# Altium project microcp.prjpcb
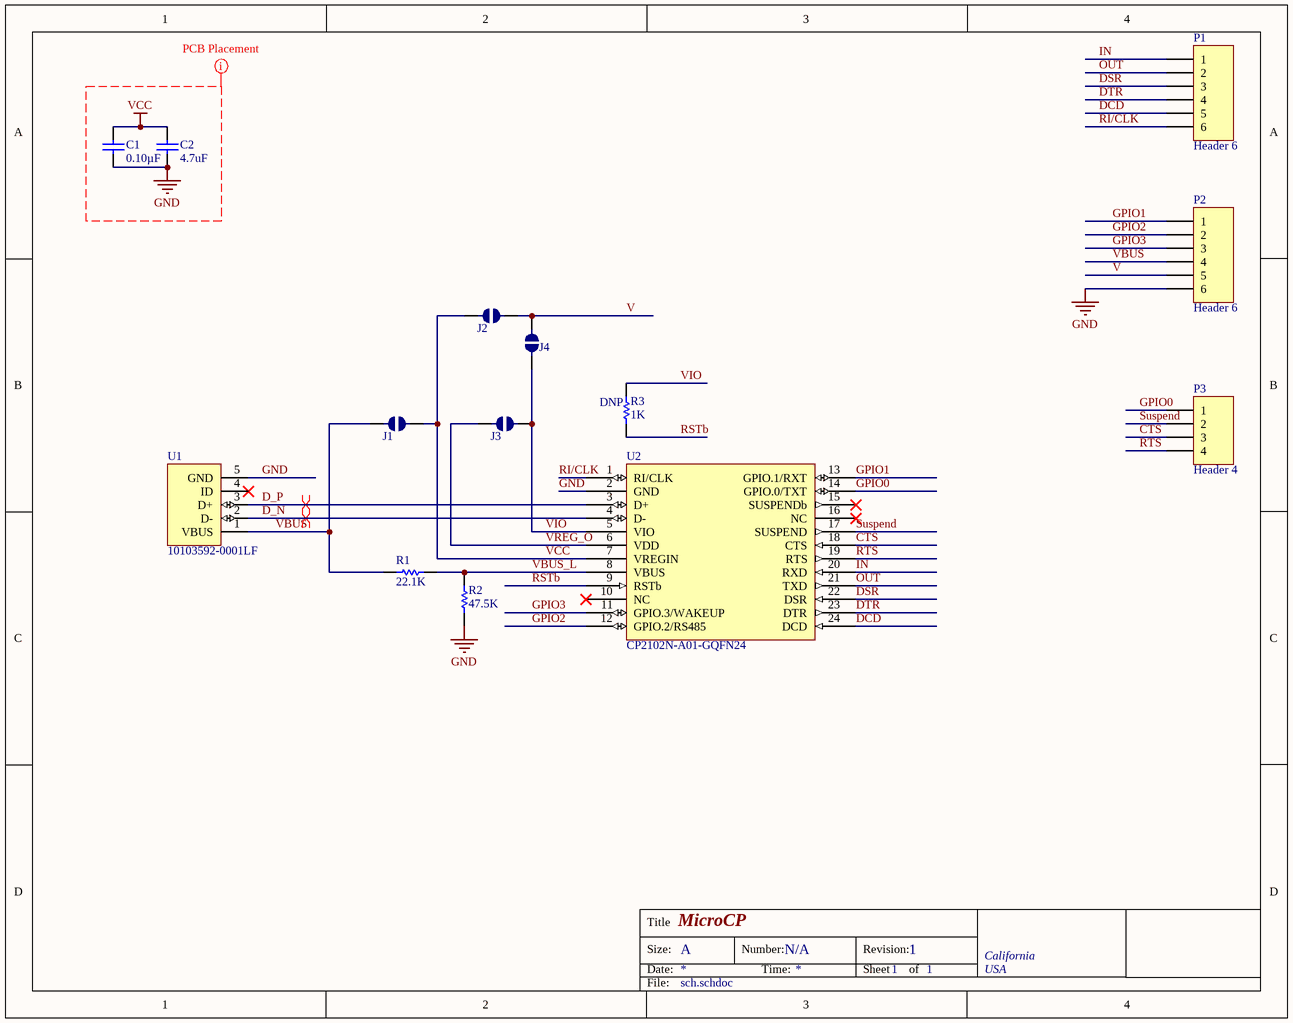
[diagram p0: sch.schdoc]
1 sheet, 14 parts. Net scope: global (net labels, ports and power ports of the same name join across sheets).
Board file: pcb.pcbdoc

## Sheet sch.schdoc: MicroCP
size A; Author: Faisal T. Abu-Nimeh; CompanyName: abunimeh; DrawnBy: Faisal Abu-Nimeh; Engineer: Faisal Abu-Nimeh; Address3: California; Address4: USA; DocumentNumber: N/A; Revision: 1; SheetNumber: 1; SheetTotal: 1; ProjectName: MicroCP

### Parts
C1  0.10µF  [0402L]
C2  4.7uF  [0402L]
J1  Jumper_Open  [JO]  (value not drawn)
J2  Jumper_Open  [JO]  (value not drawn)
J3  Jumper_Open  [JO]  (value not drawn)
J4  Jumper_Open  [JO]  (value not drawn)
P1  Header 6  [HDR1X6]
P2  Header 6  [HDR1X6]
P3  Header 4  [HDR1X4]
R1  22.1K  [0402L]
R2  47.5K  [0402L]
R3  1K  [RESC0402(1005)_L]
U1  10103592-0001LF  [10103592-0001LF_NOSLOTS]
U2  CP2102N-A01-GQFN24  [CP2102N-QFN24]

### Nets
GND: C1.1 C2.1 P2.6 R2.1 U1.0 U1.5(GND) U2.0(GND) U2.2(GND)
VCC: C1.2 C2.2 J1.2 J2.1 U2.7(VREGIN)
CTS: P3.3 U2.18(CTS)
D_N: U1.2(D-) U2.4(D-)
D_P: U1.3(D+) U2.3(D+)
DCD: P1.5 U2.24(DCD)
DSR: P1.3 U2.22(DSR)
DTR: P1.4 U2.23(DTR)
GPIO0: P3.1 U2.14(GPIO.0/TXT)
GPIO1: P2.1 U2.13(GPIO.1/RXT)
GPIO2: P2.2 U2.12(GPIO.2/RS485)
GPIO3: P2.3 U2.11(GPIO.3/WAKEUP)
IN: P1.1 U2.20(RXD)
OUT: P1.2 U2.21(TXD)
RI/CLK: P1.6 U2.1(RI/CLK)
RSTb: R3.1 U2.9(RSTb)
RTS: P3.4 U2.19(RTS)
Suspend: P3.2 U2.17(SUSPEND)
V: J2.2 J4.2 P2.5
VBUS: J1.1 P2.4 R1.2 U1.1(VBUS)
VBUS_L: R1.1 R2.2 U2.8(VBUS)
VIO: J3.2 J4.1 R3.2 U2.5(VIO)
VREG_O: J3.1 U2.6(VDD)

Not connected (* = marked no-connect by the designer): U1 4(ID)*; U2 10(NC)* 15(SUSPENDb)* 16(NC)*

### Layout directives
differential pair: D_N, D_P
mark named PCB Placement: GND, VCC

### Notes on the sheet
- Title
- Size:
- Date:
- A
- Number:
- Time:
- Revision:
- Sheet
- of
- File:

### Library data of the parts
C1 = CMP-1034-02061-1: CAP CER 0.1UF 16V X7R 0402; Manufacturer: Murata Electronics North America; Manufacturer Part Number: GRM155R71C104KA88D; Tolerance: ±10%; Supplier 1: Digi-Key; Supplier Part Number 1: 490-6328-2-ND; RoHS: RoHS Compliant; Category: Capacitors; Stock 1: 8950000; Pricing 1: 50000=0.0017, 100000=0.00138 (USD); Packaging: Tape & Reel (TR); Part Status: Active; Capacitance: 0.10µF; Voltage - Rated: 16V; Temperature Coefficient: X7R; Operating Temperature: -55°C ~ 125°C; Features: -; Ratings: -; Applications: General Purpose; Failure Rate: *; Mounting Type: Surface Mount, MLCC; Package / Case: 0402 (1005 Metric); Size / Dimension: 0.039" L x 0.020" W (1.00mm x 0.50mm); Height - Seated (Max): -; Thickness (Max): 0.022" (0.55mm); Lead Spacing: -; Lead Style: -; ComponentLink1URL: http://www.murata.com/~/media/webrenewal/support/library/catalog/products/capacitor/mlcc/c02e.pdf; ComponentLink1Description: http://www.murata.com/~/media/webrenewal/support/library/catalog/products/capacitor/mlcc/c02e.pdf; Value: 0.10µF
C2 = CMP-1034-02136-1: CAP 4.7uF 6.3V ±10% 0402 SMD; Manufacturer Part Number: GRM155R60J475ME47D; Manufacturer: Murata; Case-EIA: 0402; Tolerance: Â±10%; Case-Metric: 1005; Technology: SMT; Value: 4.7uF; Max Thickness: 0.6 mm; Rated Voltage: 6.3 V; Supplier 1: Digi-Key; Supplier Part Number 1: 490-5915-2-ND
J1-J4 = Jumper_Open: Open SMD Solder Jumper; DNP: DNP
P1 P2 = Header 6: Header, 6-Pin; LatestRevisionDate: 17-Jul-2002; LatestRevisionNote: Re-released for DXP Platform.; Publisher: Altium Limited; DNP: DNP
P3 = Header 4: Header, 4-Pin; LatestRevisionDate: 17-Jul-2002; LatestRevisionNote: Re-released for DXP Platform.; Publisher: Altium Limited; DNP: DNP
R1 = CMP-1011-00001-1: 22.1K SMD Resistor 0402; Manufacturer: Panasonic Electronic Components; Manufacturer Part Number: ERJ-2RKF2212X; Tolerance: None; Case-Metric: 1005; Case-EIA: 0402; Power (Watts): 0.1W, 1/10W; Temperature Coefficient: ±100ppm/°C; Power: None; Value: 22.1K; Technology: SMT; Supplier 1: Digi-Key; Supplier Part Number 1: P22.1KLTR-ND; RoHS: RoHS Compliant; Category: Resistors; Stock 1: 280000; Pricing 1: 10000=0.00281, 30000=0.00247, 50000=0.00226, 100000=0.00222 (USD); Packaging: Tape & Reel (TR); Part Status: Active; Resistance (Ohms): 22.1k; Composition: Thick Film; Features: Automotive AEC-Q200; Operating Temperature: -55°C ~ 155°C; Package / Case: 0402 (1005 Metric); Supplier Device Package: 0402; Size / Dimension: 0.039" L x 0.020" W (1.00mm x 0.50mm); Height: 0.016" (0.40mm); Number of Terminations: 2; Failure Rate: -; ComponentLink1URL: http://industrial.panasonic.com/www-cgi/jvcr13pz.cgi?E+PZ+3+AOA0002+ERJ2RKF2212X+7+WW; ComponentLink1Description: http://industrial.panasonic.com/www-cgi/jvcr13pz.cgi?E+PZ+3+AOA0002+ERJ2RKF2212X+7+WW
R2 = CMP-1011-00001-1: 47.5K SMD Resistor 0402; Manufacturer Part Number: ERJ-2RKF4752X; Manufacturer: Panasonic; Tolerance: None; Case-Metric: 1005; Case-EIA: 0402; Power (Watts): 0.1W, 1/10W; Temperature Coefficient: ±100ppm/°C; Power: None; Value: 47.5K; Technology: SMT; Supplier 1: Digi-Key; Supplier Part Number 1: P47.5KLTR-ND; RoHS: RoHS Compliant; Category: Resistors; Stock 1: 260000; Pricing 1: 10000=0.00281, 30000=0.00247, 50000=0.00226, 100000=0.00222 (USD); Packaging: Tape & Reel (TR); Part Status: Active; Resistance (Ohms): 47.5k; Composition: Thick Film; Features: Automotive AEC-Q200; Operating Temperature: -55°C ~ 155°C; Package / Case: 0402 (1005 Metric); Supplier Device Package: 0402; Size / Dimension: 0.039" L x 0.020" W (1.00mm x 0.50mm); Height: 0.016" (0.40mm); Number of Terminations: 2; Failure Rate: -; ComponentLink1URL: http://industrial.panasonic.com/www-cgi/jvcr13pz.cgi?E+PZ+3+AOA0002+ERJ2RKF4752X+7+WW; ComponentLink1Description: http://industrial.panasonic.com/www-cgi/jvcr13pz.cgi?E+PZ+3+AOA0002+ERJ2RKF4752X+7+WW
R3 = CMP-1011-00001-1: RES SMD 1K OHM 1% 1/10W 0402; Manufacturer: Panasonic Electronic Components; Manufacturer Part Number: ERJ-2RKF1001X; Power (Watts): 0.1W, 1/10W; Temperature Coefficient: ±100ppm/°C; DNP: DNP; Supplier 1: Digi-Key; Supplier Part Number 1: P1.00KLCT-ND; RoHS: RoHS Compliant; Category: Resistors; Stock 1: 4728383; Pricing 1: 1=0.1, 50=0.015, 100=0.011, 250=0.0084, 500=0.00674, 1000=0.00496, 5000=0.00355 (USD); Packaging: Cut Tape (CT); Part Status: Active; Resistance (Ohms): 1k; Tolerance: ±1%; Composition: Thick Film; Features: Automotive AEC-Q200; Operating Temperature: -55°C ~ 155°C; Package / Case: 0402 (1005 Metric); Supplier Device Package: 0402; Size / Dimension: 0.039" L x 0.020" W (1.00mm x 0.50mm); Height: 0.016" (0.40mm); Number of Terminations: 2; Failure Rate: -; ComponentLink1URL: http://industrial.panasonic.com/www-cgi/jvcr13pz.cgi?E+PZ+3+AOA0002+ERJ2RKF1001X+7+WW; ComponentLink1Description: http://industrial.panasonic.com/www-cgi/jvcr13pz.cgi?E+PZ+3+AOA0002+ERJ2RKF1001X+7+WW
U1 = 10103592-0001LF: CONN RCPT REV MICRO USB TYPE B; Manufacturer: Amphenol FCI; Connector Type: USB - micro B; Number of Contacts: 5; Gender: Receptacle; Specifications: USB 2.0; Supplier 1: Digi-Key; Manufacturer Part Number: 10103592-0001LF; RoHS: RoHS Compliant; Category: Connectors, Interconnects; Stock 1: 17913; Pricing 1: 1=0.76, 10=0.712, 25=0.6412, 50=0.57, 100=0.5462, 250=0.49872, 500=0.47498 (USD); Packaging: Cut Tape (CT); Part Status: Active; Mounting Type: Surface Mount, Right Angle, Horizontal; Features: Shielded, Solder Retention; Ingress Protection: -; ComponentLink1URL: http://portal.fciconnect.com/Comergent//fci/drawing/10103592.pdf; ComponentLink1Description: http://portal.fciconnect.com/Comergent//fci/drawing/10103592.pdf; Supplier Part Number 1: 609-4048-1-ND
U2 = CP2102N-QFN24: USB-UART; Manufacturer: Silicon Labs; Supplier 1: Digi-Key; Manufacturer Part Number: CP2102N-A01-GQFN24; RoHS: RoHS Compliant; Category: Integrated Circuits (ICs); Stock 1: 57; Pricing 1: 1=1.35, 25=1.3044, 100=1.2543, 1000=1.18675 (USD); Part Status: Active; ComponentLink1URL: http://www.silabs.com/support%20documents/technicaldocs/cp2102n-datasheet.pdf; ComponentLink1Description: http://www.silabs.com/support%20documents/technicaldocs/cp2102n-datasheet.pdf